# Altium project MSXII_driverControls.PrjPcb
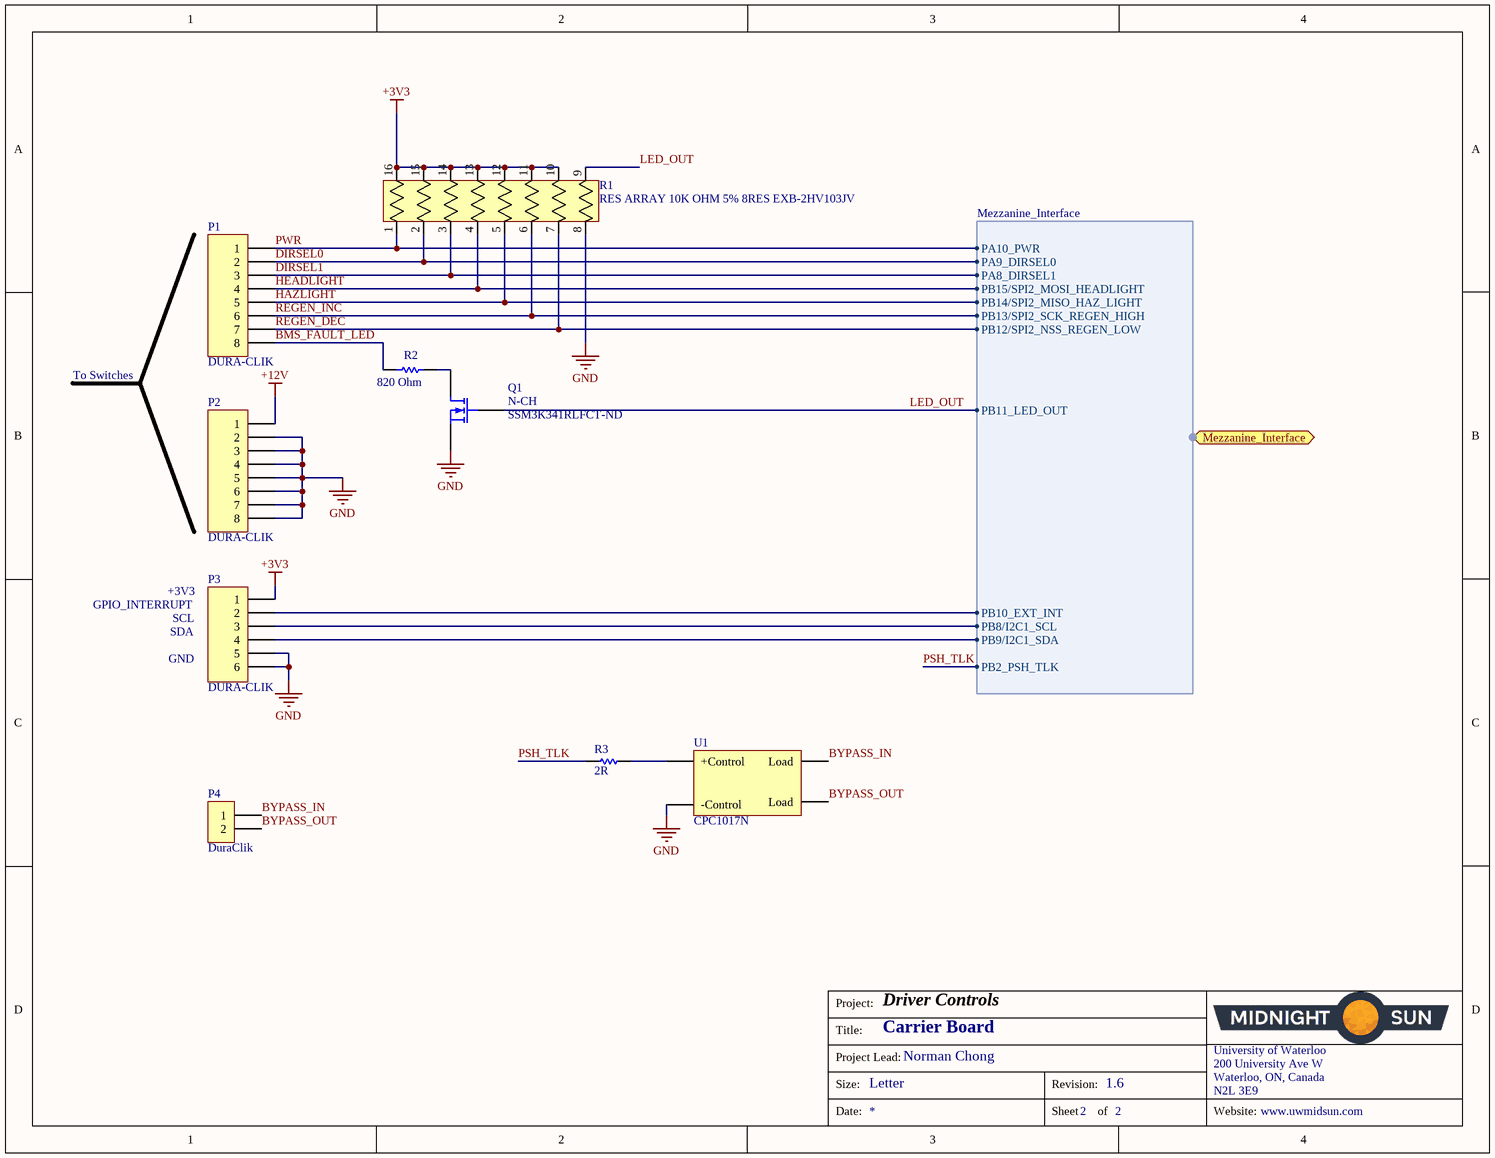
[diagram p0: Carrierboard.SchDoc]
2 sheets, 10 parts. Net scope: flat (ports and power ports of the same name join across sheets).
Board file: Carrierboard_PCB.PcbDoc
Sheets:
  Carrierboard.SchDoc
  DriverControlsMezzanine.SchDoc

## Sheet Carrierboard.SchDoc: Carrier Board
size Letter; Author: Norman Chong; Organization: Midnight Sun Solar Rayce Car Team; Address1: University of Waterloo; Address2: 200 University Ave W; Address3: Waterloo, ON, Canada; Address4: N2L 3E9; Revision: 1.6; SheetNumber: 2; SheetTotal: 2; Website: www.uwmidsun.com; ProjectName: Driver Controls

### Parts
(Parts that share a designator on the sheet are numbered #1, #2 ... from top to bottom, then left to right.)
P1#1  DURA-CLIK  [CONN, 8POS DURA-CLIK VERT]
P2  DURA-CLIK  [CONN, 8POS DURA-CLIK VERT]
P3  DURA-CLIK  [CONN, 6POS DURA-CLIK VERT]
P4  Series: DuraClik  [CONN, 2POS Dura-Click]  (hidden comment: CONN 2POS DURA-CLIK 0.079")
Q1  N-CH  Supplier Part Number 1: SSM3K341RLFCT-ND  [SOT23]
R1  RES ARRAY 10K OHM 5% 8RES EXB-2HV103JV  [RES ARRAY, 8 POS 1506]
R2  820 Ohm  [RES, 0603]
R3  2R  [RES, 0603]
U1  CPC1017N  [RELAY SOP4]

### Ports
Mezzanine_Interface (harness Mezzanine_Interface)

### Harnesses
Mezzanine_Interface: PA10_PWR, PA9_DIRSEL0, PA8_DIRSEL1, PB15/SPI2_MOSI_HEADLIGHT, PB14/SPI2_MISO_HAZ_LIGHT, PB13/SPI2_SCK_REGEN_HIGH, PB12/SPI2_NSS_REGEN_LOW, PB11_LED_OUT, PB10_EXT_INT, PB8/I2C1_SCL, PB9/I2C1_SDA, PB2_PSH_TLK

### Nets
+3V3: P3.1 R1.10 R1.11 R1.12 R1.13 R1.14 R1.15 R1.16
+12V: P2.1
GND: P2.2 P2.3 P2.4 P2.5 P2.6 P2.7 P2.8 P3.5 P3.6 Q1.2(S) R1.8 U1.2(-Control)
BMS_FAULT_LED: P1#1.8 R2.1
BYPASS_IN: P4.1 U1.4(Load)
BYPASS_OUT: P4.2 U1.3(Load)
DIRSEL0: P1#1.2 R1.2 ; port Mezzanine_Interface.PA9_DIRSEL0
DIRSEL1: P1#1.3 R1.3 ; port Mezzanine_Interface.PA8_DIRSEL1
HAZLIGHT: P1#1.5 R1.5 ; port Mezzanine_Interface.PB14/SPI2_MISO_HAZ_LIGHT
HEADLIGHT: P1#1.4 R1.4 ; port Mezzanine_Interface.PB15/SPI2_MOSI_HEADLIGHT
LED_OUT: Q1.1(G) R1.9 ; port Mezzanine_Interface.PB11_LED_OUT
PB8/I2C1_SCL: P3.3 ; port Mezzanine_Interface.PB8/I2C1_SCL
PB9/I2C1_SDA: P3.4 ; port Mezzanine_Interface.PB9/I2C1_SDA
PSH_TLK: R3.1 ; port Mezzanine_Interface.PB2_PSH_TLK
PWR: P1#1.1 R1.1 ; port Mezzanine_Interface.PA10_PWR
REGEN_DEC: P1#1.7 R1.7 ; port Mezzanine_Interface.PB12/SPI2_NSS_REGEN_LOW
REGEN_INC: P1#1.6 R1.6 ; port Mezzanine_Interface.PB13/SPI2_SCK_REGEN_HIGH
NetP3_2: P3.2 ; port Mezzanine_Interface.PB10_EXT_INT
NetQ1_3: Q1.3(D) R2.2
NetR3_2: R3.2 U1.1(+Control)

### Notes on the sheet
- To Switches
- GPIO_INTERRUPT
- +3V3
- SDA
- SCL
- GND
- Project:
- Title:
- Size:
- Project Lead:
- Letter
- Revision:
- University of Waterloo
- 200 University Ave W
- Waterloo, ON, Canada
- N2L 3E9
- Date:
- Sheet
- of
- Website:

### Library data of the parts
P1#1 P2 = CONN 8POS DURA-CLIK 0.079": 8 Positions Header, Shrouded Connector 0.079" (2.00mm) Surface Mount, Vertical Tin; Manufacturer: Molex; Manufacturer Part Number: 5600200820; Supplier: Digi-Key; Supplier Part Number: WM10868CT-ND
P3 = CONN 6POS DURA-CLIK 0.079": 6 Positions Header, Shrouded Connector 0.079" (2.00mm) Surface Mount, Vertical Tin; Manufacturer: Molex; Manufacturer Part Number: 5600200820; Supplier 1: Digi-Key; Supplier Part Number 1: WM10866CT-ND
P4 = CONN 2POS DURA-CLIK 0.079": 2 Positions Header, Shrouded Connector 0.079" (2.00mm) Surface Mount, Right Angle Tin; Manufacturer 1: Molex, LLC; Manufacturer Part Number 1: 5023520200; Style: Board to Cable/Wire; Shrouding: Shrouded - 4 Wall; Number of Positions: 2; Number of Positions Loaded: All; Contact Length - Mating: 0.135" (3.45mm); Material Flammability Rating: UL94 V-0; Mated Stacking Heights: 11mm; Supplier 1: Digi-Key; Supplier Part Number 1: WM7169CT-ND; Packaging: Cut Tape (CT); Part Status: Active; Connector Type: Header; Contact Type: Male Pin; Number of Rows: 1; Row Spacing - Mating: -; Mounting Type: Surface Mount, Right Angle; Termination: Solder; Fastening Type: Latch Lock; Contact Length - Post: -; Overall Contact Length: -; Insulation Height: 0.252" (6.40mm); Contact Shape: Square; Contact Finish - Mating: Tin; Contact Finish Thickness - Mating: -; Contact Finish - Post: Tin; Contact Material: Copper Alloy; Insulation Material: Polyamide (PA), Nylon; Operating Temperature: -; Ingress Protection: -; Insulation Color: Natural; Current Rating: -; Contact Finish Thickness - Post: -; ComponentLink1URL: http://www.molex.com/pdm_docs/sd/5023520200_sd.pdf; ComponentLink1Description: http://www.molex.com/pdm_docs/sd/5023520200_sd.pdf; Voltage: -; Pitch - Mating: 0.079" (2.00mm)
Q1 = MOSFET N-CH 60V 6A 1.2W SOT-23F: N-Channel 60V 6A (Ta) 1.2W (Ta) Surface Mount SOT-23F; pin to pad: 1>3 3>1; Supplier 1: Digi-Key
R1 = RES ARRAY 10K OHM 5% 8RES EXB-2HV103JV: RES ARRAY SMD 10K 5% 62.5mW 1506; Vendor: Panasonic; C: Copyright (C) 2015 Accelerated Designs. All rights reserved; Value: Value; Copyright: Copyright (C) 2015 Accelerated Designs. All rights reserved; Manufacturer_Part_Number: EXB-2HV103JV; Supplier 1: Digi-Key; Supplier Part Number 1: Y1103CT-ND
R2 = RES 820 OHM 5% 1/4W 0603: RES SMD 820 OHM 5% 1/4W 0603; Manufacturer 1: Rohm Semiconductor; Manufacturer Part Number 1: ESR03EZPJ821; Temperature Coefficient: ±200ppm/°C; Resistance: 820; Supplier 1: Digi-Key; Supplier Part Number 1: RHM820DCT-ND; Packaging: Cut Tape (CT); Part Status: Active; Composition: Thick Film; Operating Temperature: -55°C ~ 155°C; Package / Case: 0603 (1608 Metric); Supplier Device Package: 0603; Size / Dimension: 0.063" L x 0.031" W (1.60mm x 0.80mm); Height - Seated (Max): 0.022" (0.55mm); Failure Rate: -; ComponentLink1URL: http://www.rohm.com/web/global/datasheet/ESR01MZPF/esr-e; ComponentLink1Description: http://www.rohm.com/web/global/datasheet/ESR01MZPF/esr-e; Tolerance: ±5%; Power: 1/4W
R3 = RES 2 OHM 5% 1/10W 0603: 2 Ohm ±1% 0.1W, 1/10W Chip Resistor 0603; Manufacturer: Yageo; Manufacturer Part Number: RC0603FR-072RL; Supplier: Digi-Key; Supplier Part Number: 311-2.00HRTR-ND; Supplier 1: Digi-Key; Supplier Part Number 1: 311-2.00HRCT-ND
U1 = RELAY CPC1017N SPST 100mA: Relay Solid-State SPST-NO 4-SOP; Manufacturer: IXYS Integrated Circuits Division; Manufacturer Part Number: CPC1017NTR; Supplier: Digi-Key; Supplier Part Number: CLA233DKR-ND; Supplier 1: Digi-Key; Supplier Part Number 1: CLA233CT-ND

## Sheet DriverControlsMezzanine.SchDoc: Mezzanine Pinout
size Letter; Author: Norman Chong; Revision: 1.19; SheetNumber: 1; SheetTotal: 2; Website: www.uwmidsun.com; ProjectName: Driver Controls
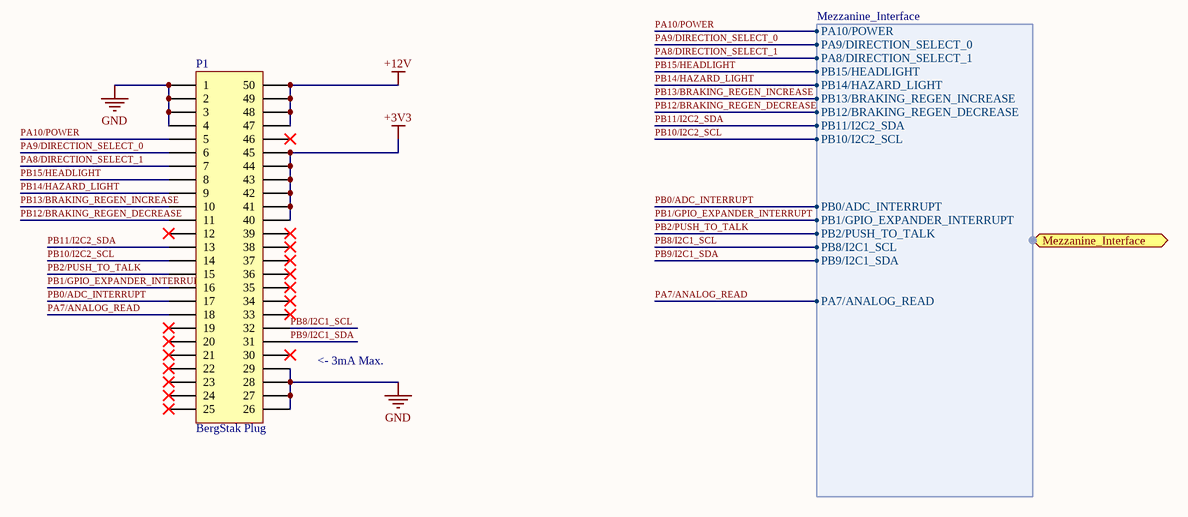
[diagram p1: DriverControlsMezzanine.SchDoc]

### Parts
(Parts that share a designator on the sheet are numbered #1, #2 ... from top to bottom, then left to right.)
P1#2  Series: BergStak Plug  [CONN, Bergstak 50 Pos Plug]  (hidden comment: CONN 50POS Bergstak Plug 0.02")

### Ports
Mezzanine_Interface (harness Mezzanine_Interface)

### Harnesses
Mezzanine_Interface: PA10/POWER, PA9/DIRECTION_SELECT_0, PA8/DIRECTION_SELECT_1, PB15/HEADLIGHT, PB14/HAZARD_LIGHT, PB13/BRAKING_REGEN_INCREASE, PB12/BRAKING_REGEN_DECREASE, PB10/I2C2_SCL, PB8/I2C1_SCL, PB9/I2C1_SDA, PB2/PUSH_TO_TALK, PB0/ADC_INTERRUPT, PB1/GPIO_EXPANDER_INTERRUPT, PB11/I2C2_SDA, PA7/ANALOG_READ

### Nets
+3V3: P1#2.40 P1#2.41 P1#2.42 P1#2.43 P1#2.44 P1#2.45
+12V: P1#2.47 P1#2.48 P1#2.49 P1#2.50
GND: P1#2.1 P1#2.2 P1#2.3 P1#2.4 P1#2.26 P1#2.27 P1#2.28 P1#2.29
PA7/ANALOG_READ: P1#2.18 ; port Mezzanine_Interface.PA7/ANALOG_READ
PA8/DIRECTION_SELECT_1: P1#2.7 ; port Mezzanine_Interface.PA8/DIRECTION_SELECT_1
PA9/DIRECTION_SELECT_0: P1#2.6 ; port Mezzanine_Interface.PA9/DIRECTION_SELECT_0
PA10/POWER: P1#2.5 ; port Mezzanine_Interface.PA10/POWER
PB0/ADC_INTERRUPT: P1#2.17 ; port Mezzanine_Interface.PB0/ADC_INTERRUPT
PB1/GPIO_EXPANDER_INTERRUPT: P1#2.16 ; port Mezzanine_Interface.PB1/GPIO_EXPANDER_INTERRUPT
PB2/PUSH_TO_TALK: P1#2.15 ; port Mezzanine_Interface.PB2/PUSH_TO_TALK
PB8/I2C1_SCL: P1#2.32 ; port Mezzanine_Interface.PB8/I2C1_SCL
PB9/I2C1_SDA: P1#2.31 ; port Mezzanine_Interface.PB9/I2C1_SDA
PB10/I2C2_SCL: P1#2.14 ; port Mezzanine_Interface.PB10/I2C2_SCL
PB11/I2C2_SDA: P1#2.13 ; port Mezzanine_Interface.PB11/I2C2_SDA
PB12/BRAKING_REGEN_DECREASE: P1#2.11 ; port Mezzanine_Interface.PB12/BRAKING_REGEN_DECREASE
PB13/BRAKING_REGEN_INCREASE: P1#2.10 ; port Mezzanine_Interface.PB13/BRAKING_REGEN_INCREASE
PB14/HAZARD_LIGHT: P1#2.9 ; port Mezzanine_Interface.PB14/HAZARD_LIGHT
PB15/HEADLIGHT: P1#2.8 ; port Mezzanine_Interface.PB15/HEADLIGHT

Not connected (* = marked no-connect by the designer): P1#2 12* 19* 20* 21* 22* 23* 24* 25* 30* 33* 34* 35* 36* 37* 38* 39* 46*

### Notes on the sheet
- <- 3mA Max.
- Project:
- Title:
- Size:
- Project Lead:
- Letter
- Revision:
- University of Waterloo
- 200 University Ave W
- Waterloo, ON, Canada
- N2L 3E9
- Date:
- Sheet
- of
- Website:

### Library data of the parts
P1#2 = CONN 50POS Bergstak Plug 0.02": 50 Position Connector Plug, Outer Shroud Contacts Surface Mount Gold; Manufacturer 1: Amphenol FCI; Manufacturer Part Number 1: 10132797-055100LF; Number of Positions: 50; Mated Stacking Heights: 5mm; Pitch: 0.020" (0.50mm); Digikey PN: 609-5226-1-ND

## Nets that join several sheets
+3V3: Carrierboard (8 pins), DriverControlsMezzanine (6 pins)
+12V: Carrierboard (P2.1), DriverControlsMezzanine (P1#2.47 P1#2.48 P1#2.49 P1#2.50)
GND: Carrierboard (12 pins), DriverControlsMezzanine (8 pins)
PB8/I2C1_SCL: Carrierboard (P3.3), DriverControlsMezzanine (P1#2.32)
PB9/I2C1_SDA: Carrierboard (P3.4), DriverControlsMezzanine (P1#2.31)